# EAGLE schematic design (EAGLE 9.6.2)
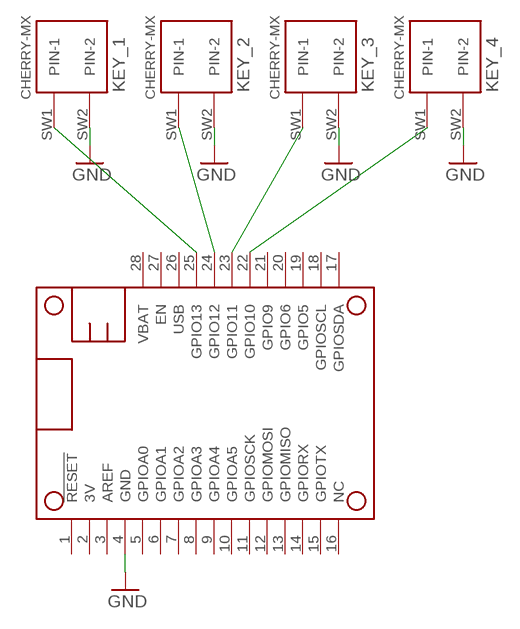
[diagram p0: schematic, sheet 1]

## Parts
KEY_1  CHERRY-MX  [CHERRY-MX]
KEY_2  CHERRY-MX  [CHERRY-MX]
KEY_3  CHERRY-MX  [CHERRY-MX]
KEY_4  CHERRY-MX  [CHERRY-MX]
MS1  FEATHERWING_NODIM  [FEATHERWING_DIM]

## Nets
GND: KEY_1.SW2(PIN-2) KEY_2.SW2(PIN-2) KEY_3.SW2(PIN-2) KEY_4.SW2(PIN-2) MS1.4(GND)
N$1: KEY_1.SW1(PIN-1) MS1.25(GPIO13)
N$2: KEY_2.SW1(PIN-1) MS1.24(GPIO12)
N$3: KEY_3.SW1(PIN-1) MS1.23(GPIO11)
N$4: KEY_4.SW1(PIN-1) MS1.22(GPIO10)
Unconnected: MS1.1(!RESET) MS1.2(3V) MS1.3(AREF) MS1.5(GPIOA0) MS1.6(GPIOA1) MS1.7(GPIOA2) MS1.8(GPIOA3) MS1.9(GPIOA4) MS1.10(GPIOA5) MS1.11(GPIOSCK) MS1.12(GPIOMOSI) MS1.13(GPIOMISO) MS1.14(GPIORX) MS1.15(GPIOTX) MS1.16(NC) MS1.17(GPIOSDA) MS1.18(GPIOSCL) MS1.19(GPIO5) MS1.20(GPIO6) MS1.21(GPIO9) MS1.26(USB) MS1.27(EN) MS1.28(VBAT)

## Library data of the parts
KEY_1-KEY_4 = cherrymx:CHERRY-MX: Cherry MX series keyswitch
MS1 = adafruit:FEATHERWING